# EAGLE design ATTINY_SERVO_BOARD (EAGLE 9.5.2)
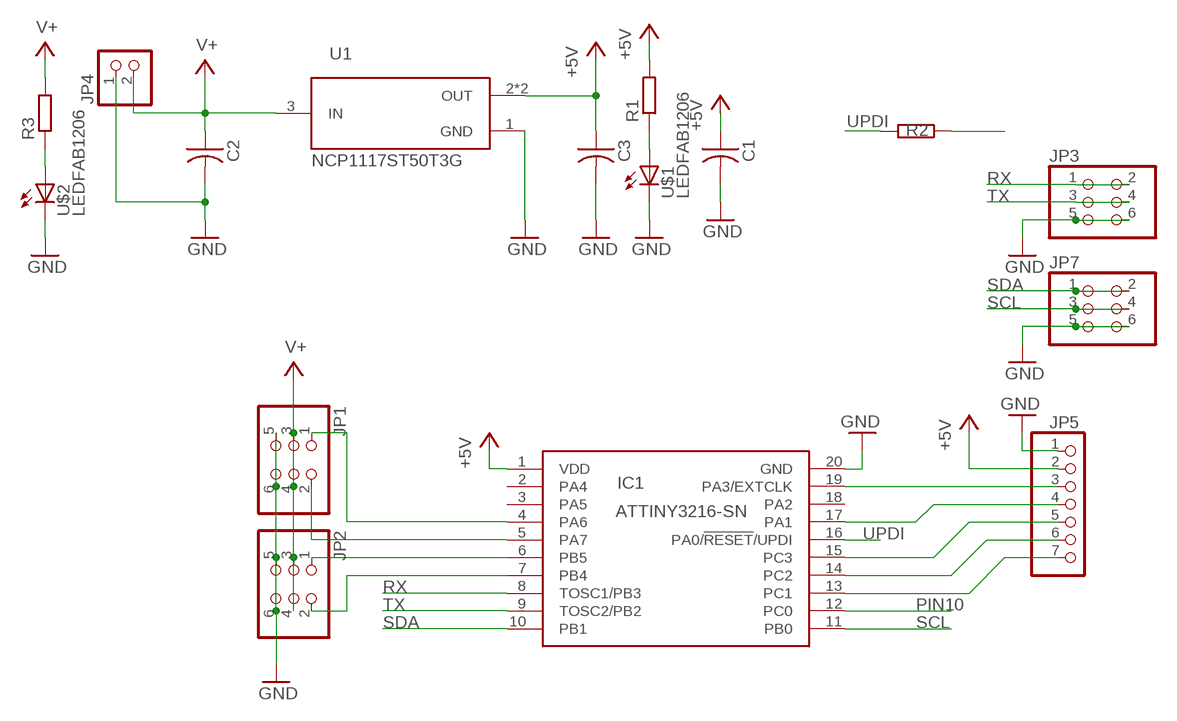
[diagram p0: schematic, sheet 1]

## Parts
C1  CAP-US1206  [C1206]
C2  CAP-US1206  [C1206]
C3  CAP-US1206  [C1206]
IC1  ATTINY3216-SN  [SOIC127P1030X265-20N]
JP1  PINHD-2X03_2.54-SMD  [2X03SMD]
JP2  PINHD-2X03_2.54-SMD  [2X03SMD]
JP3  PINHD-2X03_2.54-SMD  [2X03SMD]
JP4  PINHD-1X02_2.54-SMD-90°  [1X02SMD/90]
JP5  PINHD-1X07_2.54-SMD-90°  [1X07SMD/90]
JP7  PINHD-2X03_2.54-SMD  [2X03SMD]
R1  R-EU_R1206  [R1206]
R2  R-EU_R1206  [R1206]
R3  R-EU_R1206  [R1206]
U1  NCP1117ST50T3G  [SOT230P700X180-4N]
U$1  LEDFAB1206  [LED1206FAB]
U$2  LEDFAB1206  [LED1206FAB]

## Nets
+5V: C1.1 C3.1 IC1.1(VDD) JP5.2 R1.2 U1.2(OUT) U1.4(OUT)
GND: C1.2 C2.2 C3.2 IC1.20(GND) JP1.5 JP1.6 JP2.5 JP2.6 JP3.5 JP3.6 JP4.1 JP5.1 JP7.5 JP7.6 U1.1(GND) U$1.2(C) U$2.2(C)
N$1: IC1.19(PA3/EXTCLK) JP5.3
N$2: R2.1
N$3: R1.1 U$1.1(A)
N$4: IC1.7(PB4) JP2.2
N$5: IC1.6(PB5) JP2.1
N$6: IC1.5(PA7) JP1.2
N$7: IC1.4(PA6) JP1.1
N$8: R3.1 U$2.1(A)
N$9: IC1.17(PA1) JP5.4
N$10: IC1.15(PC3) JP5.5
N$11: IC1.14(PC2) JP5.6
N$12: IC1.13(PC1) JP5.7
PIN10: IC1.12(PC0)
RX: IC1.8(TOSC1/PB3) JP3.1 JP3.2
SCL: IC1.11(PB0) JP7.3 JP7.4
SDA: IC1.10(PB1) JP7.1 JP7.2
TX: IC1.9(TOSC2/PB2) JP3.3 JP3.4
UPDI: IC1.16(PA0/!RESET!/UPDI) R2.2
V+: C2.1 JP1.3 JP1.4 JP2.3 JP2.4 JP4.2 R3.2 U1.3(IN)
Unconnected: IC1.2(PA4) IC1.3(PA5) IC1.18(PA2)

## Library data of the parts
C1-C3 = fab:CAP-US
IC1 = OPENBOT:ATTINY3216-SN: MICROCHIP - ATTINY3216-SN - 8 Bit MCU, AVR Family ATtiny3216 Series Microcontrollers, 20 MHz, 32 KB, 2 KB, 20 Pins, SOIC Source: Datasheet <https://componentsearchengine.com/Datasheets/1/ATTINY3216-SN.pdf>; AVAILABILITY: Unavailable; DESCRIPTION: AVR tinyAVR™ 1 Microcontroller IC 8-Bit 20MHz 32KB (32K x 8) FLASH 20-SOIC; DIGIKEY-PURCHASE-URL: https://snapeda.com/shop?store=DigiKey&id=4652473; MF: Microchip Technology; MOUSER-PURCHASE-URL: https://snapeda.com/shop?store=Mouser&id=4652473; MP: ATTINY3216-SN; PACKAGE: SOIC-20 Microchip Technology; PRICE: None
JP1-JP3 JP7 = pinhead-2:PINHD-2X03: PIN HEADER
JP4 = pinhead-2:PINHD-1X02: PIN HEADER
JP5 = pinhead-2:PINHD-1X07: PIN HEADER
R1-R3 = rcl:R-EU_: RESISTOR, European symbol; SPICEPREFIX: R
U1 = OPENBOT:NCP1117ST50T3G: 1.0 A Low-Dropout Positive ,Fixed and Adjustable,Voltage Regulators Buy Part <https://snapeda.com/parts/NCP1117ST50T3G/ON%20Semiconductor/view-part/?ref=eda>; AVAILABILITY: Good; DESCRIPTION: Linear Voltage Regulator IC 1 Output 1A SOT-223; DIGIKEY-PURCHASE-URL: https://snapeda.com/shop?store=DigiKey&id=836318; MF: ON Semiconductor; MOUSER-PURCHASE-URL: https://snapeda.com/shop?store=Mouser&id=836318; MP: NCP1117ST50T3G; PACKAGE: SOT-223 ON Semiconductor; PRICE: None
U$1 U$2 = fab:LED: LED

## Board
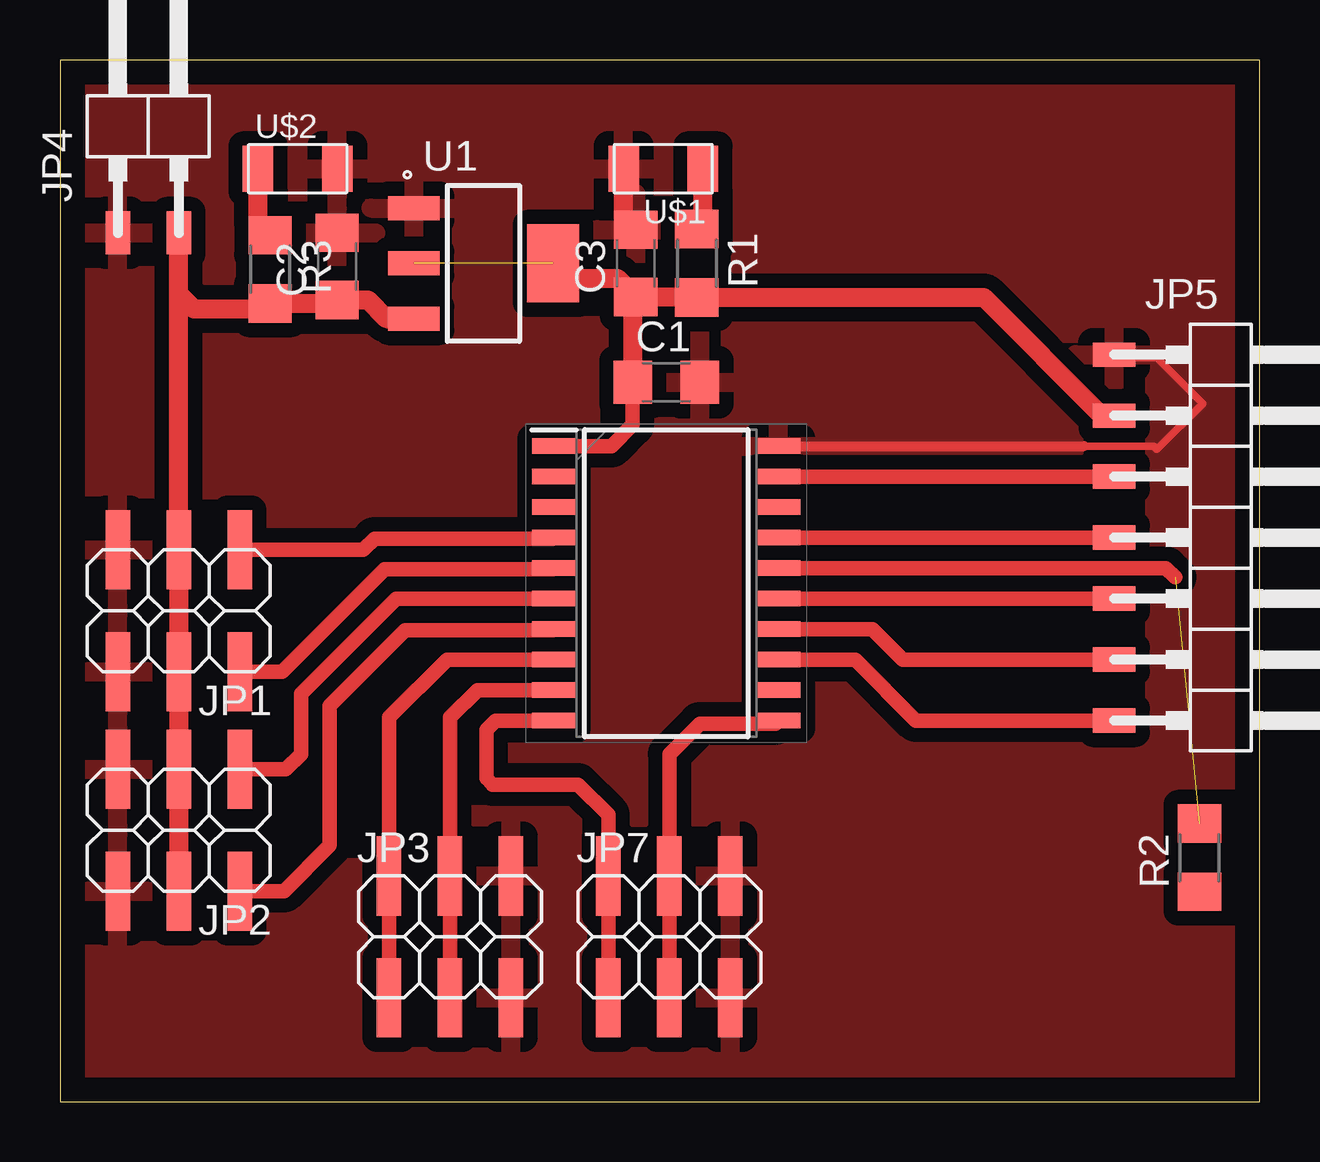
[diagram p1: board, top side]

Size 50 x 43.4 mm. Coordinates in mm from the lower left corner, seen from the top.
Outline: 0,0 50,0 50,43.4 0,43.4 0,0
Copper layers (1*16): Top 0.035mm / dielectric 1.5mm / Bottom 0.035mm
Design rules "default *": minimum track width 12mil, minimum drill 0.35mm, track to track 0.6mm, track to pad 0.6mm, pad to pad 0.6mm, via to via 0.6mm, smd to smd 0.6mm, copper to edge 40mil, drill to drill 20mil, minimum pad ring 10mil, minimum via ring 8mil, stop-mask expansion 4mil, vias tented up to drill 0mil, thermal gap 24mil

### Footprints (pad centres in the part's own frame; a part is rotated, then mirrored left to right if it is on the bottom)
C1206 = smd 1.6 x 1.8: 1 -1.4,0; 2 1.4,0
SOIC127P1030X265-20N = smd 1.85 x 0.65: 1 -4.675,5.715; 2 -4.675,4.445; 3 -4.675,3.175; 4 -4.675,1.905; 5 -4.675,0.635; 6 -4.675,-0.635; 7 -4.675,-1.905; 8 -4.675,-3.175; 9 -4.675,-4.445; 10 -4.675,-5.715; 11 4.675,-5.715; 12 4.675,-4.445; 13 4.675,-3.175; 14 4.675,-1.905; 15 4.675,-0.635; 16 4.675,0.635; 17 4.675,1.905; 18 4.675,3.175; 19 4.675,4.445; 20 4.675,5.715
2X03SMD = smd 1.016 x 3.302: 1 -1.27,-3.81; 2 -1.27,1.27; 3 1.27,-3.81; 4 1.27,1.27; 5 3.81,-3.81; 6 3.81,1.27
1X02SMD/90 = smd 1.016 x 1.778: 1 -1.27,-5.08; 2 1.27,-5.08
1X07SMD/90 = smd 1.016 x 1.778: 1 -1.27,-5.08; 2 1.27,-5.08; 3 3.81,-5.08; 4 6.35,-5.08; 5 8.89,-5.08; 6 11.43,-5.08; 7 13.97,-5.08
R1206 = smd 1.6 x 1.803: 1 -1.422,0; 2 1.422,0
SOT230P700X180-4N = smd 2.15 x 1: 1 -2.9,2.3; 2 -2.9,0; 3 -2.9,-2.3 | smd 2.15 x 3.25: 4 2.9,0
LED1206FAB = smd 1.27 x 1.905: 1 -1.651,0; 2 1.651,0

### Placement (x,y rotation side)
C1  25.27,29.97 0 top
C2  11.56,34.8 90 top
C3  24,34.92 90 top
IC1  25.27,21.59 0 top
JP1  6.22,19.18 180 top
JP2  6.22,10.03 180 top
JP3  14.99,8.13 0 top
JP4  3.68,41.27 0 top
JP5  49.02,29.84 270 top
JP7  24.13,8.13 0 top
R1  26.54,34.92 270 top
R2  47.5,10.16 90 top
R3  8.76,34.67 270 top
U1  17.65,34.92 0 top
U$1  25.15,38.86 180 top
U$2  9.91,38.86 0 top

### Tracks (layer width: path | path; a pad name or v marks a point on that pad's centre or on a via)
+5V  (1 unrouted)
  Top 0.6: C1.1 23.87,28.19 22.99,27.3 IC1.1
  Top 0.8: C3.1 26.52,33.52 R1.2 38.51,33.5 43.43,28.57 JP5.2 | C3.1 23.87,33.39 C1.1 | C3.1 23.24,34.29 20.83,34.29 20.55,34.56 U1.4
GND
  Top 0.305: JP5.1 44.07,30.99 45.72,30.99 47.62,29.08 45.72,27.18 45.59,27.3 42.68,27.3 | 30.07,27.18 IC1.20
  Top 0.406: IC1.20 42.68,27.3
  Top 0.8: C3.2 23.5,36.83 U$1.2
  pour Top: -1.02,42.93 50.8,42.93 50.8,-5.33 -1.02,-5.33
N$1
  Top 0.6: JP5.3 IC1.19
N$3
  Top 0.8: R1.1 26.8,36.6 U$1.1
N$4
  Top 0.6: IC1.7 20.55,19.64 14.39,19.64 11.25,16.5 11.25,10.67 9.34,8.76 JP2.2
N$5
  Top 0.6: JP2.1 9.41,13.84 10.05,14.48 10.05,17 14.01,20.95 IC1.6
N$6
  Top 0.6: JP1.2 9.26,17.91 13.53,22.18 20.55,22.18 IC1.5
N$7
  Top 0.6: IC1.4 20.55,23.45 13.11,23.45 12.64,22.99 JP1.1
N$8
  Top 0.8: R3.1 8.26,36.6 U$2.1
N$9
  Top 0.6: JP5.4 IC1.17
N$10
  Top 0.6: JP5.5 IC1.15
N$11
  Top 0.6: JP5.6 35.13,18.41 33.87,19.68 IC1.14
N$12
  Top 0.6: JP5.7 35.69,15.88 33.15,18.41 IC1.13
RX
  Top 0.6: IC1.8 16.13,18.41 13.72,16 JP3.2 JP3.1
SCL
  Top 0.6: IC1.11 29.82,15.75 26.67,15.75 25.4,14.48 JP7.4 JP7.3
SDA
  Top 0.6: IC1.10 18.16,15.88 17.78,15.49 17.78,13.46 18.03,13.21 21.59,13.21 22.86,11.94 JP7.2 JP7.1
TX
  Top 0.6: IC1.9 17.4,17.14 16.26,16 JP3.4 JP3.3
UPDI  (1 unrouted)
  Top 0.6: IC1.16 46.1,22.23 46.48,21.84
V+
  Top 0.8: U1.3 13.6,32.62 12.83,33.4 C2.1 11.41,33.25 R3.2 8.53,33.02 5.59,33.02 4.95,33.66 JP4.2 JP1.3 JP1.4 JP2.3 JP2.4